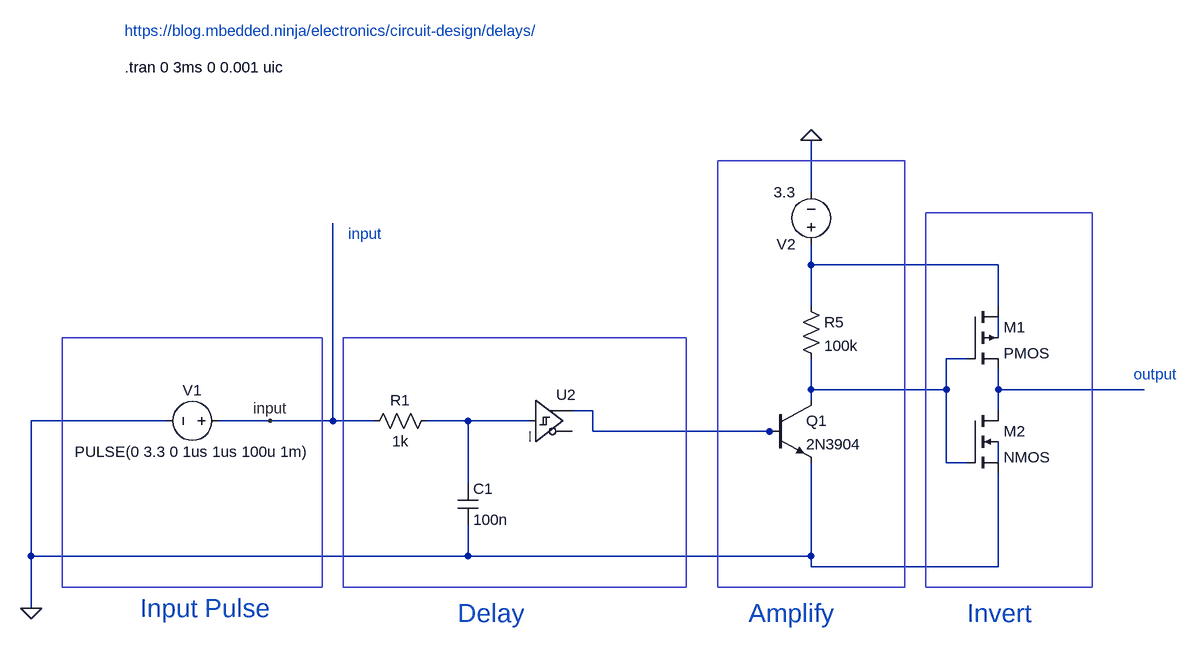
[diagram p0: schematic schmitt.asc]
schmitt.asc, the LTspice schematic file:
Version 4
SHEET 1 4500 1640
WIRE 1264 112 1264 32
WIRE 1264 224 1264 192
WIRE 1552 224 1264 224
WIRE 1264 288 1264 224
WIRE 1552 288 1552 224
WIRE 1552 336 1552 304
WIRE 1504 368 1472 368
WIRE 1264 416 1264 368
WIRE 1472 416 1472 368
WIRE 1472 416 1264 416
WIRE 1552 416 1552 384
WIRE 1776 416 1552 416
WIRE 1264 432 1264 416
WIRE 928 448 896 448
WIRE 1552 448 1552 416
WIRE 272 464 64 464
WIRE 432 464 352 464
WIRE 528 464 528 160
WIRE 528 464 432 464
WIRE 592 464 528 464
WIRE 736 464 672 464
WIRE 832 464 736 464
WIRE 928 480 928 448
WIRE 1200 480 928 480
WIRE 1216 480 1200 480
WIRE 1472 528 1472 416
WIRE 1504 528 1472 528
WIRE 1552 528 1552 496
WIRE 736 560 736 464
WIRE 64 672 64 464
WIRE 736 672 736 624
WIRE 736 672 64 672
WIRE 1264 672 1264 528
WIRE 1264 672 736 672
WIRE 1264 688 1264 672
WIRE 1552 688 1552 544
WIRE 1552 688 1264 688
WIRE 64 752 64 672
FLAG 64 752 0
FLAG 432 464 input
FLAG 1264 32 0
SYMBOL res 688 448 R90
WINDOW 0 0 56 VBottom 2
WINDOW 3 32 56 VTop 2
SYMATTR InstName R1
SYMATTR Value 1k
SYMATTR SpiceLine tol=1 pwr=0.1
SYMBOL cap 720 560 R0
SYMATTR InstName C1
SYMATTR Value 100n
SYMBOL voltage 368 464 M270
WINDOW 0 32 56 VTop 2
WINDOW 3 -32 56 VBottom 2
WINDOW 123 0 0 Left 0
WINDOW 39 0 0 Left 0
SYMATTR InstName V1
SYMATTR Value PULSE(0 3.3 0 1us 1us 100u 1m)
SYMBOL Digital\\schmitt 832 400 R0
SYMATTR InstName U2
SYMATTR SpiceLine Vt=1.5
SYMATTR SpiceLine2 Vh=0.5
SYMBOL res 1248 272 R0
SYMATTR InstName R5
SYMATTR Value 100k
SYMBOL voltage 1264 208 R180
WINDOW 123 0 0 Left 0
WINDOW 39 0 0 Left 0
SYMATTR InstName V2
SYMATTR Value 3.3
SYMBOL npn 1200 432 R0
SYMATTR InstName Q1
SYMATTR Value 2N3904
SYMBOL pmos4 1504 288 R0
SYMATTR InstName M1
SYMBOL nmos4 1504 448 R0
SYMATTR InstName M2
TEXT 208 -80 Left 2 !.tran 0 3ms 0 0.001 uic
TEXT 208 -136 Left 2 ;https://blog.mbedded.ninja/electronics/circuit-design/delays/
TEXT 1168 760 Left 4 ;Amplify
TEXT 1504 760 Left 4 ;Invert
TEXT 1760 392 Left 2 ;output
TEXT 720 760 Left 4 ;Delay
TEXT 232 752 Left 4 ;Input Pulse
TEXT 552 176 Left 2 ;input
RECTANGLE Normal 1408 720 1120 64
RECTANGLE Normal 1696 720 1440 144
RECTANGLE Normal 1072 720 544 336
RECTANGLE Normal 112 336 512 720

The netlist it stands for:
* schmitt.asc
R1 N006 input 1k tol=1 pwr=0.1
C1 N006 0 100n
V1 input 0 PULSE(0 3.3 0 1us 1us 100u 1m)
A§U2 N006 0 0 0 0 0 N005 0 SCHMITT Vt=1.5 Vh=0.5
R5 N001 N003 100k
V2 N001 0 3.3
Q1 N003 N005 0 0 2N3904
M1 N001 N003 N004 N002 PMOS
M2 N004 N003 0 N007 NMOS
.model NPN NPN
.model PNP PNP
.lib standard.bjt
.model NMOS NMOS
.model PMOS PMOS
.lib standard.mos
.tran 0 3ms 0 0.001 uic
* https://blog.mbedded.ninja/electronics/circuit-design/delays/
* Amplify
* Invert
* output
* Delay
* Input Pulse
* input
.backanno
.end